# EAGLE schematic PulseSensor (EAGLE 9.3.0)
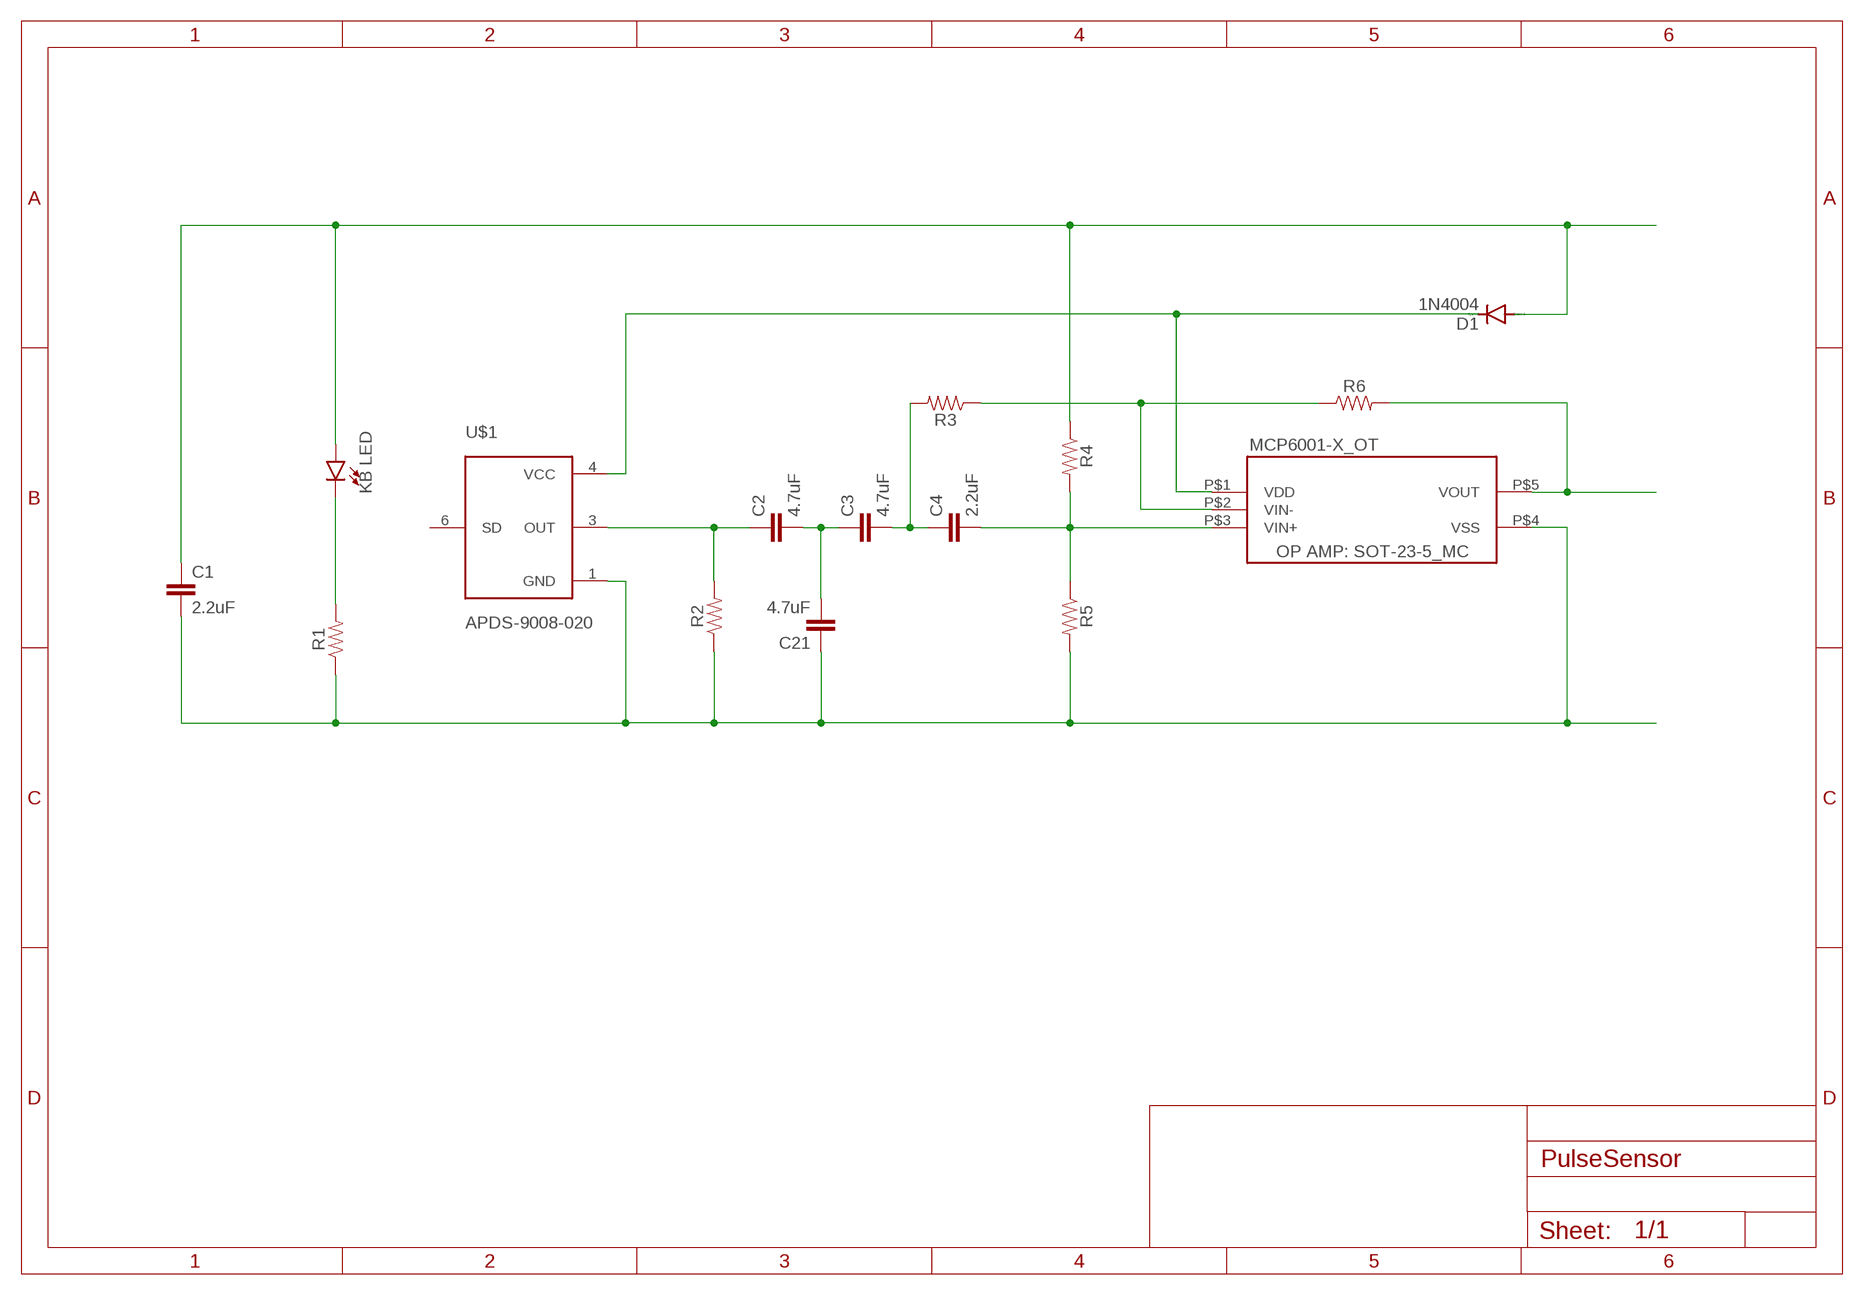
[diagram p0: schematic, sheet 1]

## Parts
C1  2.2uF  2.2UF-0603-10V-20%  [0603]
C2  4.7uF  4.7UF0603  [0603]
C3  4.7uF  4.7UF0603  [0603]
C4  2.2uF  2.2UF-0603-10V-20%  [0603]
C21  4.7uF  4.7UF0603  [0603]
D1  1N4004  [DO41-10]
R1  RESISTOR0603  [0603]
R2  RESISTOR0603  [0603]
R3  RESISTOR0603  [0603]
R4  RESISTOR0603  [0603]
R5  RESISTOR0603  [0603]
R6  RESISTOR0603  [0603]
U$1  APDS-9008-020  [LCC140P200X240X80-6]
U$2  KB_REVMNT_LED  [REVMNT_LED_FP]
U$3  MCP6001-X_SOT-23-5  [SOT-23-5]

## Nets
N$1: C2.1 R2.2 U$1.3(OUT)
N$2: C2.2 C3.1 C21.2
N$3: C3.2 C4.1 R3.2
N$4: C4.2 R4.2 R5.1 U$3.P$3(VIN+)
N$5: C1.2 C21.1 R1.1 R2.1 R5.2 U$1.1(GND) U$3.P$4(VSS)
N$6: R1.2 U$2.P$2(C)
N$9: R6.2 U$3.P$5(VOUT)
N$11: C1.1 D1.A R4.1 U$2.P$1(A)
N$12: R3.1 R6.1 U$3.P$2(VIN-)
N$13: D1.C U$1.4(VCC) U$3.P$1(VDD)
Unconnected: U$1.6(SD)

## Library data of the parts
C1 C4 = SparkFun-Capacitors:2.2UF: 2.2µF ceramic capacitors A capacitor is a passive two-terminal electrical component used to store electrical energy temporarily in an electric field.; PROD_ID: CAP-07888
C2 C3 C21 = SparkFun-Capacitors:4.7UF: 4.7µF ceramic capacitors A capacitor is a passive two-terminal electrical component used to store electrical energy temporarily in an electric field.; PROD_ID: CAP-08280
D1 = diode:1N4004: DIODE general purpose rectifier, 1 A
R1-R6 = SparkFun-Resistors:RESISTOR: Generic Resistor Package
U$1 = APDS-9008-020:APDS-9008-020: Sensor: ambient light photo; Usup: 2.4/5.5VDC; Mounting: SMT; AVAILABILITY: Unavailable; DESCRIPTION: Ambient Light Sensor Photodetector 6-Pin SMD T/R; MF: Broadcom Limited; MP: APDS-9008-020; PACKAGE: SMD-6 Broadcom; PRICE: None
U$2 = HMD_Library:KB_REVMNT_LED
U$3 = HMD_Library:MCP6001-X_SOT-23-5: MCP6001-X: Operational Amplifier, 5-Lead Plastic Small Outline Transistor SOT-23-5